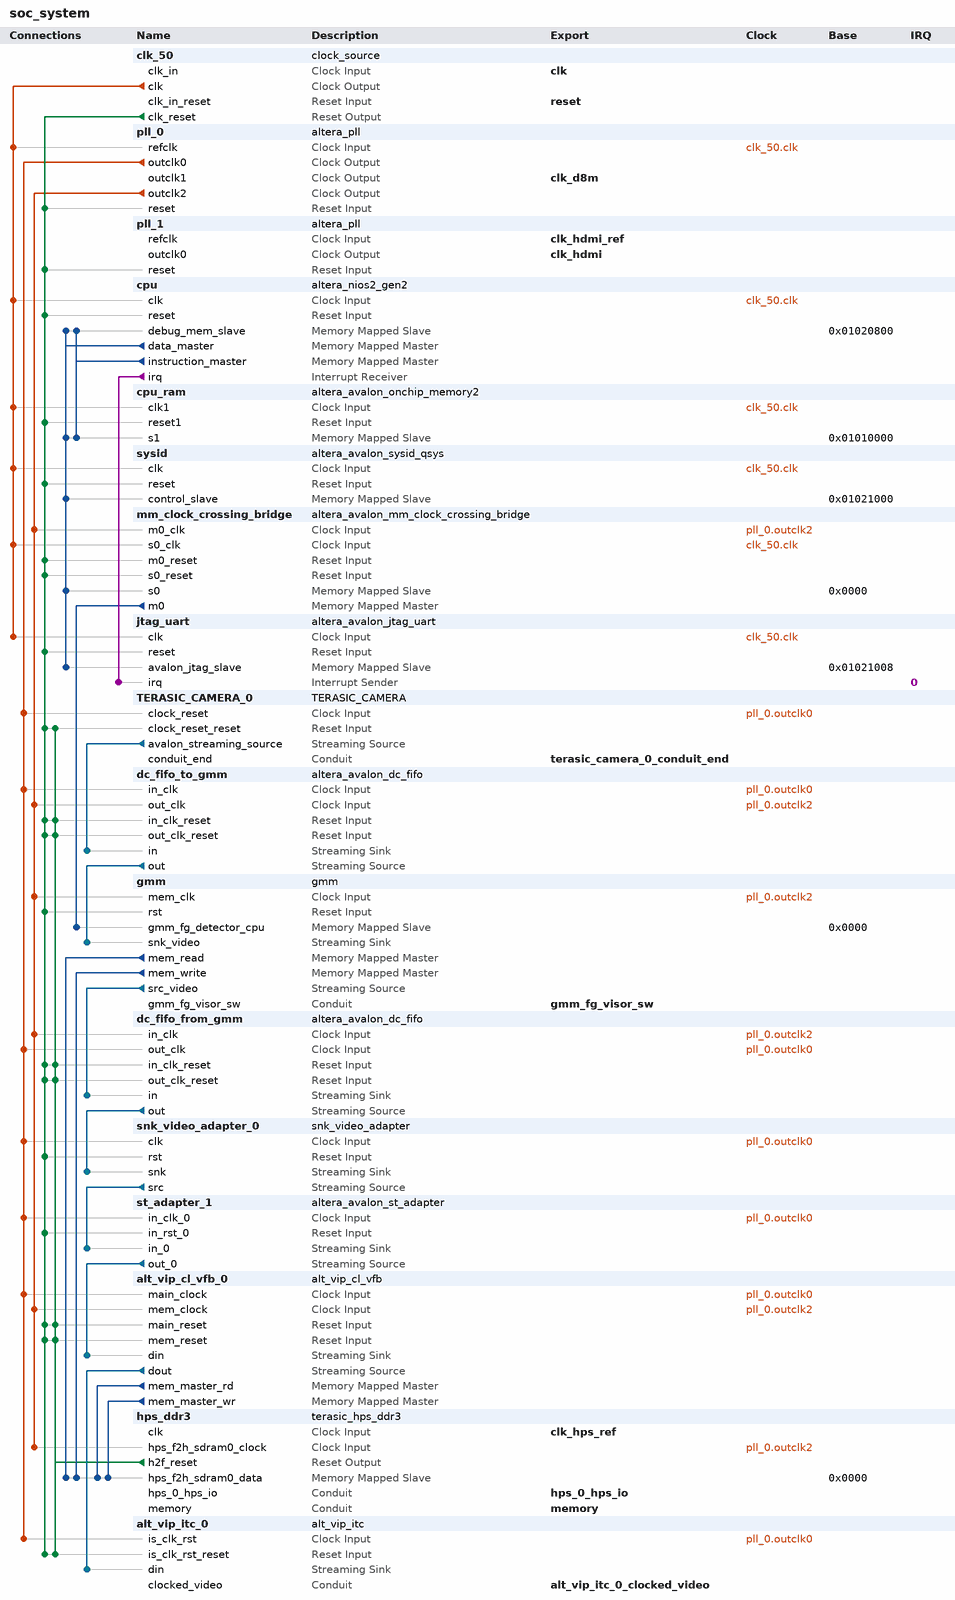
[diagram p0: system contents]
# Platform Designer (Qsys) system soc_system, Cyclone V 5CSEBA6U23I7
# Parameters at their usual value, and those the tool derives, are not listed.
package require -exact qsys 18.1
create_system soc_system
set_project_property DEVICE_FAMILY {Cyclone V}
set_project_property DEVICE 5CSEBA6U23I7

add_instance clk_50 clock_source 18.1
set_instance_parameter_value clk_50 clockFrequency 50000000

add_instance pll_0 altera_pll 18.1
set_instance_parameter_value pll_0 gui_device_speed_grade 2
set_instance_parameter_value pll_0 gui_number_of_clocks 3
set_instance_parameter_value pll_0 gui_operation_mode direct
set_instance_parameter_value pll_0 gui_output_clock_frequency0 160.0
set_instance_parameter_value pll_0 gui_output_clock_frequency1 20.0
set_instance_parameter_value pll_0 gui_output_clock_frequency2 110.0
set_instance_parameter_value pll_0 gui_pll_mode {Integer-N PLL}
set_instance_parameter_value pll_0 gui_reference_clock_frequency 50.0
set_instance_parameter_value pll_0 gui_use_locked false

add_instance pll_1 altera_pll 18.1
set_instance_parameter_value pll_1 gui_device_speed_grade 2
set_instance_parameter_value pll_1 gui_number_of_clocks 1
set_instance_parameter_value pll_1 gui_operation_mode direct
set_instance_parameter_value pll_1 gui_output_clock_frequency0 148.5
set_instance_parameter_value pll_1 gui_pll_mode {Fractional-N PLL}
set_instance_parameter_value pll_1 gui_reference_clock_frequency 50.0
set_instance_parameter_value pll_1 gui_use_locked false

add_instance cpu altera_nios2_gen2 18.1
set_instance_parameter_value cpu dcache_size 0
set_instance_parameter_value cpu exceptionSlave cpu_ram.s1
set_instance_parameter_value cpu icache_size 0
set_instance_parameter_value cpu impl Fast
set_instance_parameter_value cpu resetSlave cpu_ram.s1

add_instance cpu_ram altera_avalon_onchip_memory2 18.1
set_instance_parameter_value cpu_ram dataWidth 32
set_instance_parameter_value cpu_ram dualPort false
set_instance_parameter_value cpu_ram initMemContent true
set_instance_parameter_value cpu_ram initializationFileName onchip_mem.hex
set_instance_parameter_value cpu_ram memorySize 60000

add_instance sysid altera_avalon_sysid_qsys 18.1
set_instance_parameter_value sysid id 0

add_instance mm_clock_crossing_bridge altera_avalon_mm_clock_crossing_bridge 18.1
set_instance_parameter_value mm_clock_crossing_bridge ADDRESS_UNITS WORDS
set_instance_parameter_value mm_clock_crossing_bridge ADDRESS_WIDTH 3
set_instance_parameter_value mm_clock_crossing_bridge COMMAND_FIFO_DEPTH 4
set_instance_parameter_value mm_clock_crossing_bridge DATA_WIDTH 32
set_instance_parameter_value mm_clock_crossing_bridge MASTER_SYNC_DEPTH 2
set_instance_parameter_value mm_clock_crossing_bridge MAX_BURST_SIZE 1
set_instance_parameter_value mm_clock_crossing_bridge RESPONSE_FIFO_DEPTH 4
set_instance_parameter_value mm_clock_crossing_bridge SLAVE_SYNC_DEPTH 2
set_instance_parameter_value mm_clock_crossing_bridge USE_AUTO_ADDRESS_WIDTH 1

add_instance jtag_uart altera_avalon_jtag_uart 18.1
set_instance_parameter_value jtag_uart readBufferDepth 128
set_instance_parameter_value jtag_uart simInteractiveOptions NO_INTERACTIVE_WINDOWS
set_instance_parameter_value jtag_uart writeBufferDepth 128

add_instance TERASIC_CAMERA_0 TERASIC_CAMERA 1.0
set_instance_parameter_value TERASIC_CAMERA_0 VIDEO_H 1080
set_instance_parameter_value TERASIC_CAMERA_0 VIDEO_W 1920

add_instance dc_fifo_to_gmm altera_avalon_dc_fifo 18.1
set_instance_parameter_value dc_fifo_to_gmm BITS_PER_SYMBOL 8
set_instance_parameter_value dc_fifo_to_gmm FIFO_DEPTH 16384
set_instance_parameter_value dc_fifo_to_gmm SYMBOLS_PER_BEAT 3
set_instance_parameter_value dc_fifo_to_gmm USE_PACKETS 1

add_instance gmm gmm 1.0

add_instance dc_fifo_from_gmm altera_avalon_dc_fifo 18.1
set_instance_parameter_value dc_fifo_from_gmm BITS_PER_SYMBOL 8
set_instance_parameter_value dc_fifo_from_gmm FIFO_DEPTH 64
set_instance_parameter_value dc_fifo_from_gmm SYMBOLS_PER_BEAT 3
set_instance_parameter_value dc_fifo_from_gmm USE_PACKETS 1

add_instance snk_video_adapter_0 snk_video_adapter 1.0

add_instance st_adapter_1 altera_avalon_st_adapter 18.1
set_instance_parameter_value st_adapter_1 inBitsPerSymbol 8
set_instance_parameter_value st_adapter_1 inChannelWidth 0
set_instance_parameter_value st_adapter_1 inDataWidth 24
set_instance_parameter_value st_adapter_1 inErrorWidth 0
set_instance_parameter_value st_adapter_1 inMaxChannel 0
set_instance_parameter_value st_adapter_1 inReadyLatency 0
set_instance_parameter_value st_adapter_1 inUseEmptyPort 0
set_instance_parameter_value st_adapter_1 inUsePackets 1
set_instance_parameter_value st_adapter_1 inUseReady 1
set_instance_parameter_value st_adapter_1 inUseValid 1
set_instance_parameter_value st_adapter_1 outChannelWidth 0
set_instance_parameter_value st_adapter_1 outDataWidth 24
set_instance_parameter_value st_adapter_1 outErrorWidth 0
set_instance_parameter_value st_adapter_1 outMaxChannel 0
set_instance_parameter_value st_adapter_1 outReadyLatency 1
set_instance_parameter_value st_adapter_1 outUseEmptyPort 0
set_instance_parameter_value st_adapter_1 outUseReady 1
set_instance_parameter_value st_adapter_1 outUseValid 1

add_instance alt_vip_cl_vfb_0 alt_vip_cl_vfb 18.1
set_instance_parameter_value alt_vip_cl_vfb_0 CLOCKS_ARE_SEPARATE 1
set_instance_parameter_value alt_vip_cl_vfb_0 DROP_FRAMES 1
set_instance_parameter_value alt_vip_cl_vfb_0 DROP_REPEAT_USER 0
set_instance_parameter_value alt_vip_cl_vfb_0 IS_FRAME_READER 0
set_instance_parameter_value alt_vip_cl_vfb_0 LINE_BASED_BUFFERING 0
set_instance_parameter_value alt_vip_cl_vfb_0 MAX_HEIGHT 1080
set_instance_parameter_value alt_vip_cl_vfb_0 MAX_WIDTH 1920
set_instance_parameter_value alt_vip_cl_vfb_0 MEM_BASE_ADDR 66356320
set_instance_parameter_value alt_vip_cl_vfb_0 MEM_BUFFER_OFFSET 16777216
set_instance_parameter_value alt_vip_cl_vfb_0 MEM_PORT_WIDTH 128
set_instance_parameter_value alt_vip_cl_vfb_0 PRIORITIZE_FMAX 0
set_instance_parameter_value alt_vip_cl_vfb_0 READER_RUNTIME_CONTROL 0
set_instance_parameter_value alt_vip_cl_vfb_0 READ_BURST_TARGET 64
set_instance_parameter_value alt_vip_cl_vfb_0 READ_FIFO_DEPTH 512
set_instance_parameter_value alt_vip_cl_vfb_0 USER_PACKETS_MAX_STORAGE 1
set_instance_parameter_value alt_vip_cl_vfb_0 USE_BUFFER_OFFSET 0
set_instance_parameter_value alt_vip_cl_vfb_0 WRITE_BURST_TARGET 64
set_instance_parameter_value alt_vip_cl_vfb_0 WRITE_FIFO_DEPTH 512

add_instance hps_ddr3 terasic_hps_ddr3 1.0

add_instance alt_vip_itc_0 alt_vip_itc 14.0
set_instance_parameter_value alt_vip_itc_0 FIFO_DEPTH 7680
set_instance_parameter_value alt_vip_itc_0 H_ACTIVE_PIXELS 1920
set_instance_parameter_value alt_vip_itc_0 H_BACK_PORCH 148
set_instance_parameter_value alt_vip_itc_0 H_FRONT_PORCH 88
set_instance_parameter_value alt_vip_itc_0 H_SYNC_LENGTH 44
set_instance_parameter_value alt_vip_itc_0 NUMBER_OF_COLOUR_PLANES 3
set_instance_parameter_value alt_vip_itc_0 THRESHOLD 1919
set_instance_parameter_value alt_vip_itc_0 V_ACTIVE_LINES 1080
set_instance_parameter_value alt_vip_itc_0 V_BACK_PORCH 36
set_instance_parameter_value alt_vip_itc_0 V_FRONT_PORCH 4
set_instance_parameter_value alt_vip_itc_0 V_SYNC_LENGTH 5

# connections
add_connection clk_50.clk cpu.clk clock
add_connection clk_50.clk cpu_ram.clk1 clock
add_connection clk_50.clk jtag_uart.clk clock
add_connection clk_50.clk mm_clock_crossing_bridge.s0_clk clock
add_connection clk_50.clk pll_0.refclk clock
add_connection clk_50.clk sysid.clk clock
add_connection pll_0.outclk0 alt_vip_cl_vfb_0.main_clock clock
add_connection pll_0.outclk0 alt_vip_itc_0.is_clk_rst clock
add_connection pll_0.outclk0 dc_fifo_from_gmm.out_clk clock
add_connection pll_0.outclk0 dc_fifo_to_gmm.in_clk clock
add_connection pll_0.outclk0 snk_video_adapter_0.clk clock
add_connection pll_0.outclk0 st_adapter_1.in_clk_0 clock
add_connection pll_0.outclk0 TERASIC_CAMERA_0.clock_reset clock
add_connection pll_0.outclk2 alt_vip_cl_vfb_0.mem_clock clock
add_connection pll_0.outclk2 dc_fifo_from_gmm.in_clk clock
add_connection pll_0.outclk2 dc_fifo_to_gmm.out_clk clock
add_connection pll_0.outclk2 gmm.mem_clk clock
add_connection pll_0.outclk2 hps_ddr3.hps_f2h_sdram0_clock clock
add_connection pll_0.outclk2 mm_clock_crossing_bridge.m0_clk clock
add_connection clk_50.clk_reset alt_vip_cl_vfb_0.main_reset reset
add_connection clk_50.clk_reset alt_vip_cl_vfb_0.mem_reset reset
add_connection clk_50.clk_reset alt_vip_itc_0.is_clk_rst_reset reset
add_connection clk_50.clk_reset cpu.reset reset
add_connection clk_50.clk_reset cpu_ram.reset1 reset
add_connection clk_50.clk_reset dc_fifo_from_gmm.in_clk_reset reset
add_connection clk_50.clk_reset dc_fifo_from_gmm.out_clk_reset reset
add_connection clk_50.clk_reset dc_fifo_to_gmm.in_clk_reset reset
add_connection clk_50.clk_reset dc_fifo_to_gmm.out_clk_reset reset
add_connection clk_50.clk_reset gmm.rst reset
add_connection clk_50.clk_reset jtag_uart.reset reset
add_connection clk_50.clk_reset mm_clock_crossing_bridge.m0_reset reset
add_connection clk_50.clk_reset mm_clock_crossing_bridge.s0_reset reset
add_connection clk_50.clk_reset pll_0.reset reset
add_connection clk_50.clk_reset pll_1.reset reset
add_connection clk_50.clk_reset snk_video_adapter_0.rst reset
add_connection clk_50.clk_reset st_adapter_1.in_rst_0 reset
add_connection clk_50.clk_reset sysid.reset reset
add_connection clk_50.clk_reset TERASIC_CAMERA_0.clock_reset_reset reset
add_connection hps_ddr3.h2f_reset alt_vip_cl_vfb_0.main_reset reset
add_connection hps_ddr3.h2f_reset alt_vip_cl_vfb_0.mem_reset reset
add_connection hps_ddr3.h2f_reset alt_vip_itc_0.is_clk_rst_reset reset
add_connection hps_ddr3.h2f_reset dc_fifo_from_gmm.in_clk_reset reset
add_connection hps_ddr3.h2f_reset dc_fifo_from_gmm.out_clk_reset reset
add_connection hps_ddr3.h2f_reset dc_fifo_to_gmm.in_clk_reset reset
add_connection hps_ddr3.h2f_reset dc_fifo_to_gmm.out_clk_reset reset
add_connection hps_ddr3.h2f_reset TERASIC_CAMERA_0.clock_reset_reset reset
add_connection alt_vip_cl_vfb_0.mem_master_rd hps_ddr3.hps_f2h_sdram0_data avalon
set_connection_parameter_value alt_vip_cl_vfb_0.mem_master_rd/hps_ddr3.hps_f2h_sdram0_data baseAddress 0x0000
add_connection alt_vip_cl_vfb_0.mem_master_wr hps_ddr3.hps_f2h_sdram0_data avalon
set_connection_parameter_value alt_vip_cl_vfb_0.mem_master_wr/hps_ddr3.hps_f2h_sdram0_data baseAddress 0x0000
add_connection cpu.data_master cpu.debug_mem_slave avalon
set_connection_parameter_value cpu.data_master/cpu.debug_mem_slave baseAddress 0x01020800
add_connection cpu.data_master cpu_ram.s1 avalon
set_connection_parameter_value cpu.data_master/cpu_ram.s1 baseAddress 0x01010000
add_connection cpu.data_master jtag_uart.avalon_jtag_slave avalon
set_connection_parameter_value cpu.data_master/jtag_uart.avalon_jtag_slave baseAddress 0x01021008
add_connection cpu.data_master mm_clock_crossing_bridge.s0 avalon
set_connection_parameter_value cpu.data_master/mm_clock_crossing_bridge.s0 baseAddress 0x0000
add_connection cpu.data_master sysid.control_slave avalon
set_connection_parameter_value cpu.data_master/sysid.control_slave baseAddress 0x01021000
add_connection cpu.instruction_master cpu.debug_mem_slave avalon
set_connection_parameter_value cpu.instruction_master/cpu.debug_mem_slave baseAddress 0x01020800
add_connection cpu.instruction_master cpu_ram.s1 avalon
set_connection_parameter_value cpu.instruction_master/cpu_ram.s1 baseAddress 0x01010000
add_connection gmm.mem_read hps_ddr3.hps_f2h_sdram0_data avalon
set_connection_parameter_value gmm.mem_read/hps_ddr3.hps_f2h_sdram0_data baseAddress 0x0000
add_connection gmm.mem_write hps_ddr3.hps_f2h_sdram0_data avalon
set_connection_parameter_value gmm.mem_write/hps_ddr3.hps_f2h_sdram0_data baseAddress 0x0000
add_connection mm_clock_crossing_bridge.m0 gmm.gmm_fg_detector_cpu avalon
set_connection_parameter_value mm_clock_crossing_bridge.m0/gmm.gmm_fg_detector_cpu baseAddress 0x0000
add_connection alt_vip_cl_vfb_0.dout alt_vip_itc_0.din avalon_streaming
add_connection dc_fifo_from_gmm.out snk_video_adapter_0.snk avalon_streaming
add_connection dc_fifo_to_gmm.out gmm.snk_video avalon_streaming
add_connection gmm.src_video dc_fifo_from_gmm.in avalon_streaming
add_connection snk_video_adapter_0.src st_adapter_1.in_0 avalon_streaming
add_connection st_adapter_1.out_0 alt_vip_cl_vfb_0.din avalon_streaming
add_connection TERASIC_CAMERA_0.avalon_streaming_source dc_fifo_to_gmm.in avalon_streaming
add_connection cpu.irq jtag_uart.irq interrupt
set_connection_parameter_value cpu.irq/jtag_uart.irq irqNumber 0

# exported interfaces
add_interface alt_vip_itc_0_clocked_video conduit end
set_interface_property alt_vip_itc_0_clocked_video EXPORT_OF alt_vip_itc_0.clocked_video
add_interface clk clock sink
set_interface_property clk EXPORT_OF clk_50.clk_in
add_interface clk_d8m clock source
set_interface_property clk_d8m EXPORT_OF pll_0.outclk1
add_interface clk_hdmi clock source
set_interface_property clk_hdmi EXPORT_OF pll_1.outclk0
add_interface clk_hdmi_ref clock sink
set_interface_property clk_hdmi_ref EXPORT_OF pll_1.refclk
add_interface clk_hps_ref clock sink
set_interface_property clk_hps_ref EXPORT_OF hps_ddr3.clk
add_interface gmm_fg_visor_sw conduit end
set_interface_property gmm_fg_visor_sw EXPORT_OF gmm.gmm_fg_visor_sw
add_interface hps_0_hps_io conduit end
set_interface_property hps_0_hps_io EXPORT_OF hps_ddr3.hps_0_hps_io
add_interface memory conduit end
set_interface_property memory EXPORT_OF hps_ddr3.memory
add_interface reset reset sink
set_interface_property reset EXPORT_OF clk_50.clk_in_reset
add_interface terasic_camera_0_conduit_end conduit end
set_interface_property terasic_camera_0_conduit_end EXPORT_OF TERASIC_CAMERA_0.conduit_end

set_interconnect_requirement {$system} qsys_mm.clockCrossingAdapter HANDSHAKE
set_interconnect_requirement {$system} qsys_mm.maxAdditionalLatency 4

save_system soc_system.qsys
